# EAGLE schematic TX (EAGLE 7.1.0)
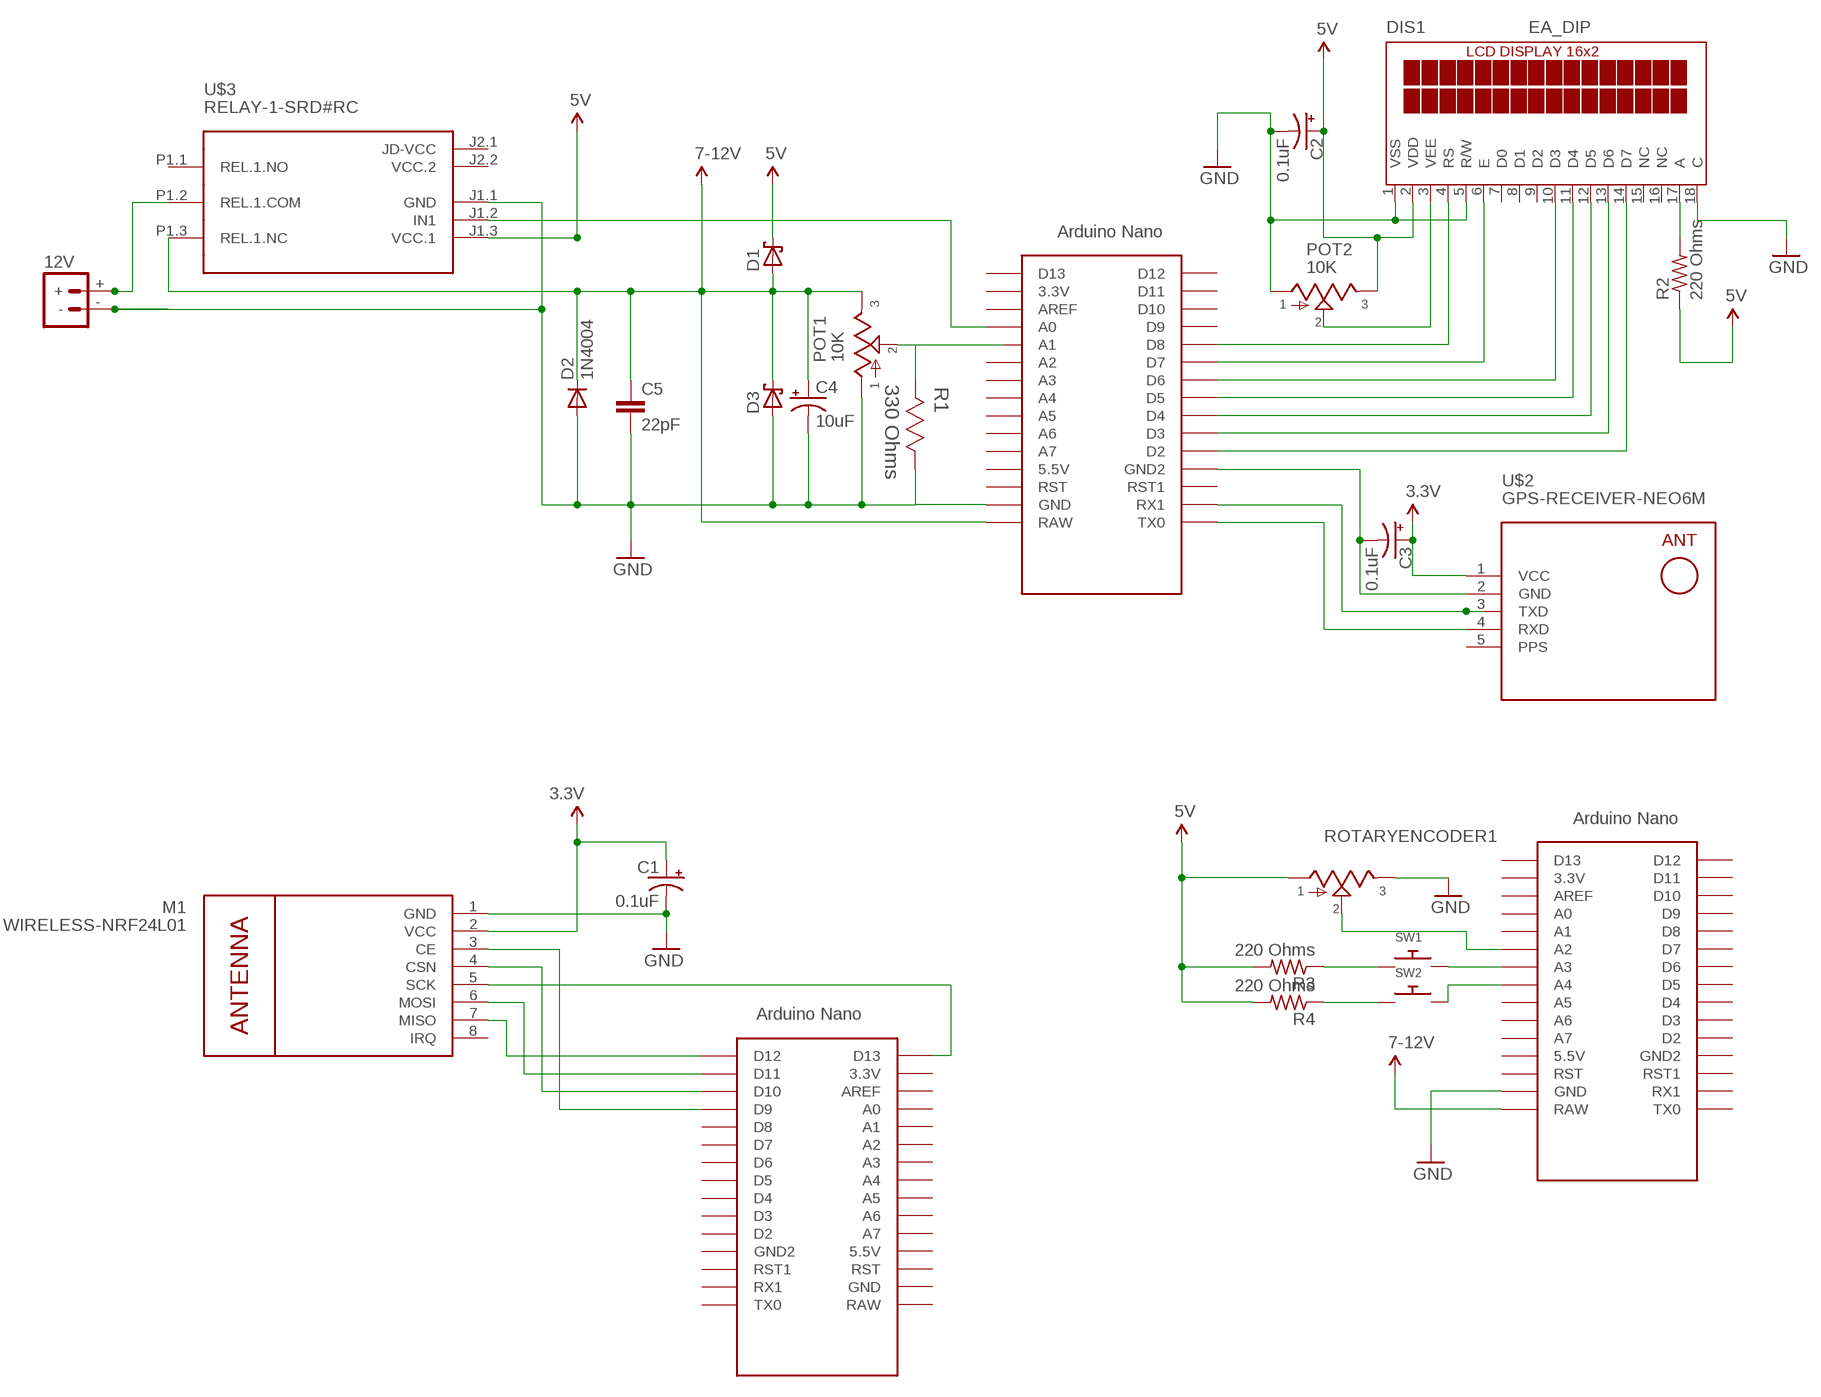
[diagram p0: schematic, sheet 1]

## Parts
12V  BATTERY_CONN_DEANS  [DEANS]
C1  0.1uF  10UF-16V-10%(TANT)  [EIA3216]
C2  0.1uF  10UF-16V-10%(TANT)  [EIA3216]
C3  0.1uF  10UF-16V-10%(TANT)  [EIA3216]
C4  10uF  10UF-16V-10%(TANT)  [EIA3216]
C5  22pF  C2,5-3  [C2.5-3]
D1  SCHOTTKY-DIODEAG  [AG]
D2  1N4004  [DO41-10]
D3  SCHOTTKY-DIODEAG  [AG]
DIS1  EA_DIP  [EA_DIP]
M1  WIRELESS-NRF24L01  [WIRELESS-NRF24L01]
POT1  10K  POT  [POT]
POT2  10K  POT  [POT]
R1  330 Ohms  CPF0603F44K2C1  [RESC1608X60N]
R2  220 Ohms  R-US_0204/2V  [0204V]
R3  220 Ohms  R-US_0204/2V  [0204V]
R4  220 Ohms  R-US_0204/2V  [0204V]
ROTARYENCODER1  POT  [POT]
SW1  SWITCH_PUSHBUTTONC&K_KSS  [BTN_CK_KSS]
SW2  SWITCH_PUSHBUTTONC&K_KSS  [BTN_CK_KSS]
U$1  NANO  [NANO]
U$2  GPS-RECEIVER-NEO6M  [GPS-RECEIVER-NEO6M]
U$3  RELAY-1-SRD#RC  [RELAY-1-SRD#RC]
U$4  NANO  [NANO]
U$5  NANO  [NANO]

## Nets
12V: 12V.+ U$3.P1.2(REL.1.COM)
GND: 12V.- C1.C(-) C2.C(-) C4.C(-) C5.2 D2.A D3.A DIS1.1(VSS) DIS1.5(R/W) DIS1.18(C) M1.1(GND) POT1.1 POT2.1 R1.1(R1) ROTARYENCODER1.3 U$1.GND U$3.J1.1(GND) U$4.GND
N$1: M1.7(MISO) U$5.D12
N$2: DIS1.14(D7) U$1.D2
N$3: DIS1.13(D6) U$1.D3
N$4: DIS1.3(VEE) POT2.2
N$5: DIS1.12(D5) U$1.D4
N$6: POT1.2 R1.2(R2)
N$7: DIS1.11(D4) U$1.D5
N$8: DIS1.10(D3) U$1.D6
N$9: DIS1.6(E) U$1.D7
N$10: DIS1.4(RS) U$1.D8
N$11: DIS1.17(A) R2.2
N$12: M1.6(MOSI) U$5.D11
N$13: M1.4(CSN) U$5.D10
N$14: C3.C(-) U$1.GND1(GND2) U$2.2(GND)
N$15: U$1.RX1 U$2.3(TXD)
N$16: U$1.TX0 U$2.4(RXD)
N$17: M1.3(CE) U$5.D9
N$18: M1.5(SCK) U$5.D13
N$20: R3.1 SW1.P$1
N$21: R4.1 SW2.P$1
N$22: U$1.A0 U$3.J1.2(IN1)
N$25: SW1.P$2 U$4.A3
N$26: SW2.P$2 U$4.A4
N$29: ROTARYENCODER1.2 U$4.A2
VCC: C1.A(+) C2.A(+) C3.A(+) C4.A(+) C5.1 D1.A D1.C D2.C D3.C DIS1.2(VDD) M1.2(VCC) POT1.3 POT2.3 R2.1 R3.2 R4.2 ROTARYENCODER1.1 U$1.RAW U$2.1(VCC) U$3.J1.3(VCC.1) U$3.P1.3(REL.1.NC) U$4.RAW ; supply symbol labelled 5V, 3.3V, 7-12V
Unconnected: DIS1.7(D0) DIS1.8(D1) DIS1.9(D2) DIS1.15(NC) DIS1.16(NC) M1.8(IRQ) U$1.3.3V U$1.5V(5.5V) U$1.A1 U$1.A2 U$1.A3 U$1.A4 U$1.A5 U$1.A6 U$1.A7 U$1.AREF U$1.D9 U$1.D10 U$1.D11 U$1.D12 U$1.D13 U$1.ICSP1 U$1.ICSP2 U$1.ICSP3 U$1.ICSP4 U$1.ICSP5 U$1.ICSP6 U$1.RST U$1.RST1 U$3.J2.1(JD-VCC) U$3.P1.1(REL.1.NO) U$4.3.3V U$4.5V(5.5V) U$4.A0 U$4.A1 U$4.A5 U$4.A6 U$4.A7 U$4.AREF U$4.D2 U$4.D3 U$4.D4 U$4.D5 U$4.D6 U$4.D7 U$4.D8 U$4.D9 U$4.D10 U$4.D11 U$4.D12 U$4.D13 U$4.GND1(GND2) U$4.ICSP1 U$4.ICSP2 U$4.ICSP3 U$4.ICSP4 U$4.ICSP5 U$4.ICSP6 U$4.RST U$4.RST1 U$4.RX1 U$4.TX0 U$5.3.3V U$5.5V(5.5V) U$5.A0 U$5.A1 U$5.A2 U$5.A3 U$5.A4 U$5.A5 U$5.A6 U$5.A7 U$5.AREF U$5.D2 U$5.D3 U$5.D4 U$5.D5 U$5.D6 U$5.D7 U$5.D8 U$5.GND U$5.GND1(GND2) U$5.ICSP1 U$5.ICSP2 U$5.ICSP3 U$5.ICSP4 U$5.ICSP5 U$5.ICSP6 U$5.RAW U$5.RST U$5.RST1 U$5.RX1 U$5.TX0

## Power pins joined to a net without a drawn wire
PPS: U$2.5(PPS)
VCC.2: U$3.J2.2(VCC.2)

## Library data of the parts
12V = SparkFun-Connectors:BATTERY_CONN: Battery Connectors Various footprints for battery connections SparkFun Products: Deans Connector -M/F Pair <https://www.sparkfun.com/products/11864>; SF_ID: PRT-11864
C1-C3 = SparkFun-Capacitors:10UF-16V-10%(TANT): CAP-00811 1206/EIA-3216 Tantalum capacitor; PROD_ID: CAP-00811; VALUE: 10uF
C4 = SparkFun-Capacitors:10UF-16V-10%(TANT): CAP-00811 1206/EIA-3216 Tantalum capacitor; PROD_ID: CAP-00811
C5 = capacitor-wima:C: CAPACITOR naming: grid - package width
D1 D3 = adafruit:SCHOTTKY-DIODE: Schottky Diode
D2 = adafruit:1N4004: DIODE General purpose 1N400x type rectifier (With bigger pads) http://www.ladyada.net/library/pcb/eaglelibrary.html
DIS1 = display-lcd:EA_DIP: LCD-MODUL 2x16 - 6,68mm, INKL. KONTROLLER HD44780 Source: Data sheet <http://www.lcd-module.de/pdf/doma/dip162-d.pdf>
M1 = diy-modules:WIRELESS-NRF24L01: 2.4 GHz Wireless Module based on NRF24L01 chip More details available here: http://www.electrodragon.com/w/NRF24L01 Click here to find device on ebay.com <http://www.ebay.com/sch/nrf24l01+arduino>
POT1 POT2 ROTARYENCODER1 = gm-pots:POT: Potentiometers the arrow indicates the clockwise motion of th wiper (lug 2) fully counter clockwise there is no resistance between lugs 1 and 2 fully clockwise the resistance between lugs 1 and 2 is the value of the pot
R1 = Tyco_By_element14_Batch_1:CPF0603F44K2C1: Resistor, 0603, 44K2; MPN: CPF0603F44K2C1; OC_FARNELL: 1527652; OC_NEWARK: 51R8616; SUPPLIER: Tyco; TOLERANCE: ± 1%; VALUE: 44.2K Ohms; WATTAGE: 0.063W
R2-R4 = adafruit:R-US_: RESISTOR, American symbol
SW1 SW2 = adafruit:SWITCH_PUSHBUTTON: Buttons SOFTTOUCHSMD_SJ - Soft touch temporary push button (Super Junk Akihabara) Compatible with SKPMANE010 [Mouser: 688-SKPMAN] C&K_KSS = Digikey: KSS221GLFS
U$1 U$4 U$5 = Arduino-clone:NANO: Arduino Nano
U$2 = diy-modules:GPS-RECEIVER-NEO6M: GPS Receiver Module based on NEO-6 device Short tutorial how to use NEO-6 module with Arduino: http://www.xarg.org/2016/06/neo6mv2-gps-module-with-arduino/ NEO-6 datasheet is available here: https://www.u-blox.com/sites/default/files/products/documents/NEO-6_DataSheet_%28GPS.G6-HW-09005%29.pdf Click here to find device on ebay.com <http://www.ebay.com/sch/gyneo6mv2>
U$3 = diy-modules:RELAY-1-SRD#RC: 1-Channel Relay Module based on SRD-05VDC-SL-C relays Symbol with relays pins Click here to find device on ebay.com <http://www.ebay.com/sch/one+channel+isolated+relay+5v>